# Altium schematic sheet ADE7753.SchDoc
size A
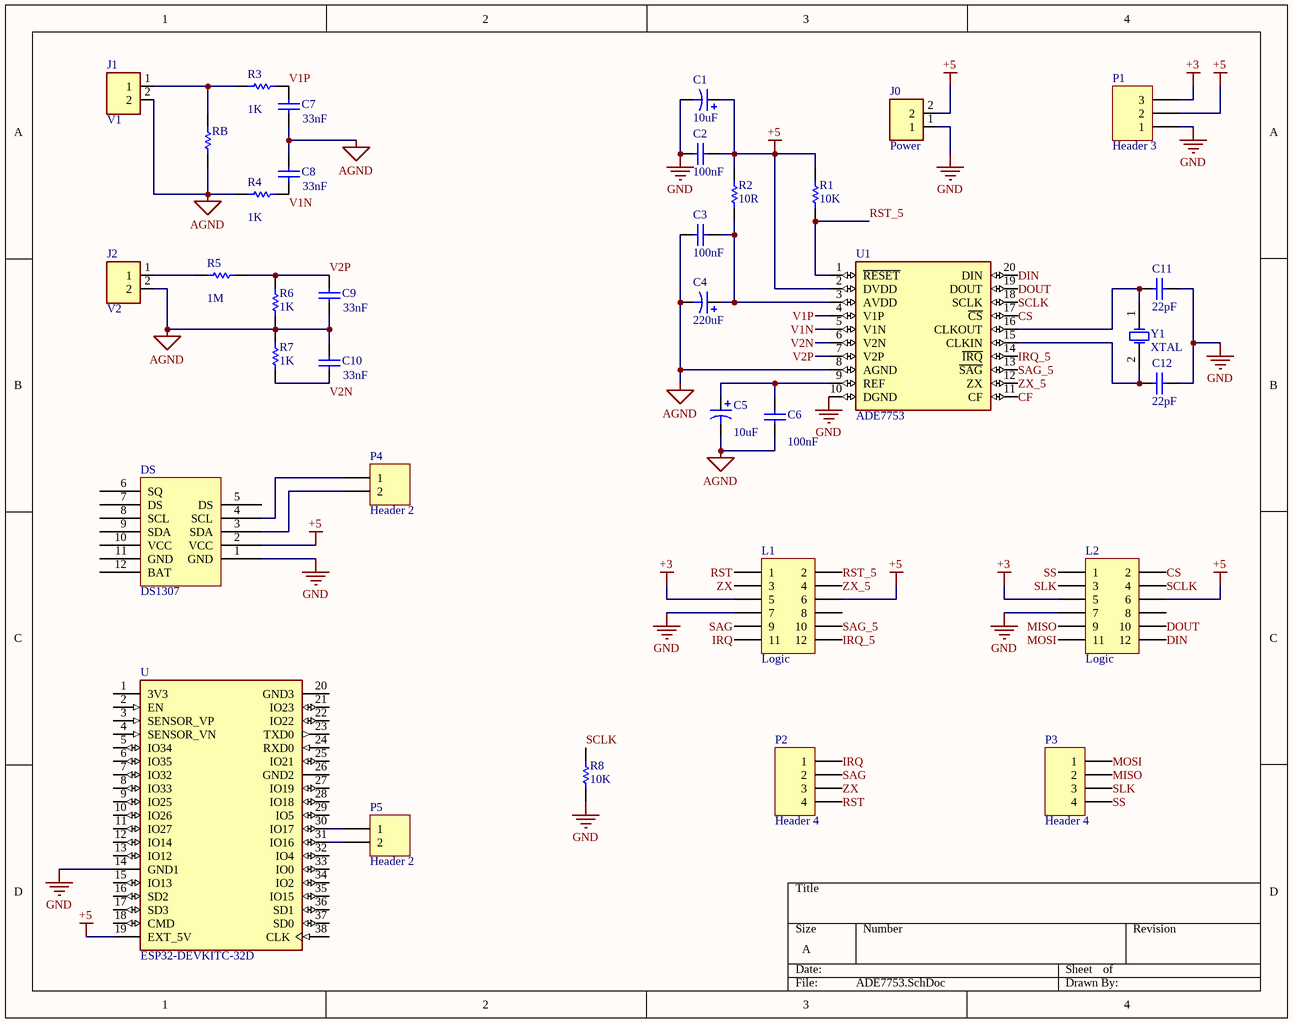
[diagram p0: ADE7753.SchDoc]

## Parts
C1  value 10uF  [Tu hóa 10uF 50v]  (hidden comment: Cap Pol1)
C2  value 100nF  [Tu Gom]  (hidden comment: Cap)
C3  value 100nF  [Tu Gom]  (hidden comment: Cap)
C4  value 220uF  [Tu hóa 10uF 50v]  (hidden comment: Cap Pol1)
C5  value 10uF  [Tu hóa 10uF 50v]  (hidden comment: Cap Pol1)
C6  value 100nF  [Tu Gom]  (hidden comment: Cap)
C7  value 33nF  [Tu Gom]  (hidden comment: Cap)
C8  value 33nF  [Tu Gom]  (hidden comment: Cap)
C9  value 33nF  [Tu Gom]  (hidden comment: Cap)
C10  value 33nF  [Tu Gom]  (hidden comment: Cap)
C11  value 22pF  [Tu Gom]  (hidden comment: Cap)
C12  value 22pF  [Tu Gom]  (hidden comment: Cap)
DS  DS1307  [PCBComponent_1]
J0  Power  [CONN_282836-2]
J1  V1  [CONN_282836-2]
J2  V2  [CONN_282836-2]
L1  Logic  [Logic level 3-5]
L2  Logic  [Logic level 3-5]
P1  Header 3  [HDR1X3]
P2  Header 4  [HDR1X4]
P3  Header 4  [HDR1X4]
P4  Header 2  [HDR1X2]
P5  Header 2  [HDR1X2]
R1  value 10K  [AXIAL-0.3]  (hidden comment: Res1)
R2  value 10R  [AXIAL-0.3]  (hidden comment: Res1)
R3  value 1K  [AXIAL-0.3]  (hidden comment: Res1)
R4  value 1K  [AXIAL-0.3]  (hidden comment: Res1)
R5  value 1M  [AXIAL-0.3]  (hidden comment: Res1)
R6  value 1K  [AXIAL-0.3]  (hidden comment: Res1)
R7  value 1K  [AXIAL-0.3]  (hidden comment: Res1)
R8  value 10K  [AXIAL-0.3]  (hidden comment: Res1)
RB  Res1  [AXIAL-0.3]  (value not drawn)
U  ESP32-DEVKITC-32D  [MODULE_ESP32-DEVKITC-32D]
U1  ADE7753  [ADE_Header]
Y1  XTAL  [3.5795 mhz crystal]

## Nets
+3: L1.5 L2.5 P1.3
+5: C1.1 C2.1 DS.2(VCC) J0.2 L1.6 L2.6 P1.2 R1.2 R2.2 U.19(EXT_5V) U1.2(DVDD)
AGND: C3.2 C4.2 C5.2 C6.1 C7.1 C8.2 C9.1 C10.2 J1.2 J2.2 R4.1 R6.1 R7.2 RB.1 U1.8(AGND)
GND: C1.2 C2.2 C11.1 C12.1 DS.1(GND) J0.1 L1.7 L2.7 P1.1 R8.1 U.14(GND1) U1.10(DGND)
CF: U1.11(CF)
CS: L2.2 U1.17(~{CS})
DIN: L2.12 U1.20(DIN)
DOUT: L2.10 U1.19(DOUT)
IRQ: L1.11 P2.1
IRQ_5: L1.12 U1.14(~{IRQ})
MISO: L2.9 P3.2
MOSI: L2.11 P3.1
RST: L1.1 P2.4
RST_5: L1.2 R1.1 U1.1(~{RESET})
SAG: L1.9 P2.2
SAG_5: L1.10 U1.13(~{SAG})
SCLK: L2.4 R8.2 U1.18(SCLK)
SLK: L2.3 P3.3
SS: L2.1 P3.4
V1N: C8.1 R4.2 U1.5(V1N)
V1P: C7.2 R3.2 U1.4(V1P)
V2N: C10.1 R7.1 U1.6(V2N)
V2P: C9.2 R5.2 R6.2 U1.7(V2P)
ZX: L1.3 P2.3
ZX_5: L1.4 U1.12(ZX)
NetC3_1: C3.1 C4.1 R2.1 U1.3(AVDD)
NetC5_1: C5.1 C6.2 U1.9(REF)
NetC11_2: C11.2 U1.16(CLKOUT) Y1.1(OSC1)
NetC12_2: C12.2 U1.15(CLKIN) Y1.2(OSC2)
NetDS_3: DS.3(SDA) P4.2
NetDS_4: DS.4(SCL) P4.1
NetJ1_1: J1.1 R3.1 RB.2
NetJ2_1: J2.1 R5.1
NetP5_1: P5.1 U.30(IO17)
NetP5_2: P5.2 U.31(IO16)

Not connected (* = marked no-connect by the designer): DS 5(DS) 6(SQ) 7(DS) 8(SCL) 9(SDA) 10(VCC) 11(GND) 12(BAT); L1 8; L2 8; U 1(3V3) 2(EN) 3(SENSOR_VP) 4(SENSOR_VN) 5(IO34) 6(IO35) 7(IO32) 8(IO33) 9(IO25) 10(IO26) 11(IO27) 12(IO14) 13(IO12) 15(IO13) 16(SD2) 17(SD3) 18(CMD) 20(GND3) 21(IO23) 22(IO22) 23(TXD0) 24(RXD0) 25(IO21) 26(GND2) 27(IO19) 28(IO18) 29(IO5) 32(IO4) 33(IO0) 34(IO2) 35(IO15) 36(SD1) 37(SD0) 38(CLK)

## Library data of the parts
C1 C4 C5 = Cap Pol1: Polarized Capacitor (Radial); Published: 8-Jun-2000; LatestRevisionDate: 17-Jul-2002; LatestRevisionNote: Re-released for DXP Platform.; PackageReference: RB7.6-15; Publisher: Altium Limited; PackageDescription: Polarized Capacitor (Radial); 2 Leads
C2 C3 C6-C12 = Cap: Capacitor; Published: 8-Jun-2000; LatestRevisionDate: 17-Jul-2002; LatestRevisionNote: Re-released for DXP Platform.; PackageReference: RAD-0.3; Publisher: Altium Limited; PackageDescription: Radial Cap, Thru-Hole; 2 Leads; 0.3 in Pin Spacing
DS = Component_1
J0-J2 = 282836-2: TERM BLOCK 2POS SIDE ENTRY 5MM; MF: {'manufacturer': u'TE Connectivity'}; Availability: Unavailable; Value: *; Package: None; MP: 282836-2; Price: None
L1 L2 = Header 6X2: Header, 6-Pin, Dual row; LatestRevisionDate: 17-Jul-2002; LatestRevisionNote: Re-released for DXP Platform.; Publisher: Altium Limited
P1 = Header 3: Header, 3-Pin; LatestRevisionDate: 17-Jul-2002; LatestRevisionNote: Re-released for DXP Platform.; Publisher: Altium Limited
P2 P3 = Header 4: Header, 4-Pin; LatestRevisionDate: 17-Jul-2002; LatestRevisionNote: Re-released for DXP Platform.; Publisher: Altium Limited
P4 P5 = Header 2: Header, 2-Pin; LatestRevisionDate: 17-Jul-2002; LatestRevisionNote: Re-released for DXP Platform.; Publisher: Altium Limited
R1-R8 = Res1: Resistor; Published: 8-Jun-2000; LatestRevisionDate: 17-Jul-2002; LatestRevisionNote: Re-released for DXP Platform.; PackageReference: AXIAL-0.3; Publisher: Altium Limited; PackageDescription: Axial Device, Thru-Hole; 2 Leads; 0.3 in Pin Spacing
RB = Res1: Resistor; Value: 1K; Published: 8-Jun-2000; LatestRevisionDate: 17-Jul-2002; LatestRevisionNote: Re-released for DXP Platform.; PackageReference: AXIAL-0.3; Publisher: Altium Limited; PackageDescription: Axial Device, Thru-Hole; 2 Leads; 0.3 in Pin Spacing
U = ESP32-DEVKITC-32D: - Transceiver; 802.11 b/g/n _Wi-Fi, WiFi, WLAN_, BluetoothÂ® Smart Ready 4.x Dual Mode For Use With ESP-WROOM-32; MF: Espressif Systems; Package: None; Price: None; Availability: Unavailable; MP: ESP32-DEVKITC-32D; SnapEDA_Link: https://www.snapeda.com/parts/ESP32-DEVKITC-32D/Espressif%20Systems/view-part/2777395/?ref=snap; Value: *
U1 = ADE7753: Single-Phase Multifunction Metering IC; MF: {'manufacturer': u'Analog Devices'}; Price: None; Value: *; Availability: Unavailable; MP: ADE7753; Package: None
Y1 = XTAL: Crystal Oscillator; Published: 8-Jun-2000; LatestRevisionDate: 17-Jul-2002; LatestRevisionNote: Re-released for DXP Platform.; PackageReference: R38; Publisher: Altium Limited; PackageDescription: Crystal, Thru-Hole; 2 Leads; Body 3.1 x 8.2 mm (Dia.xH)